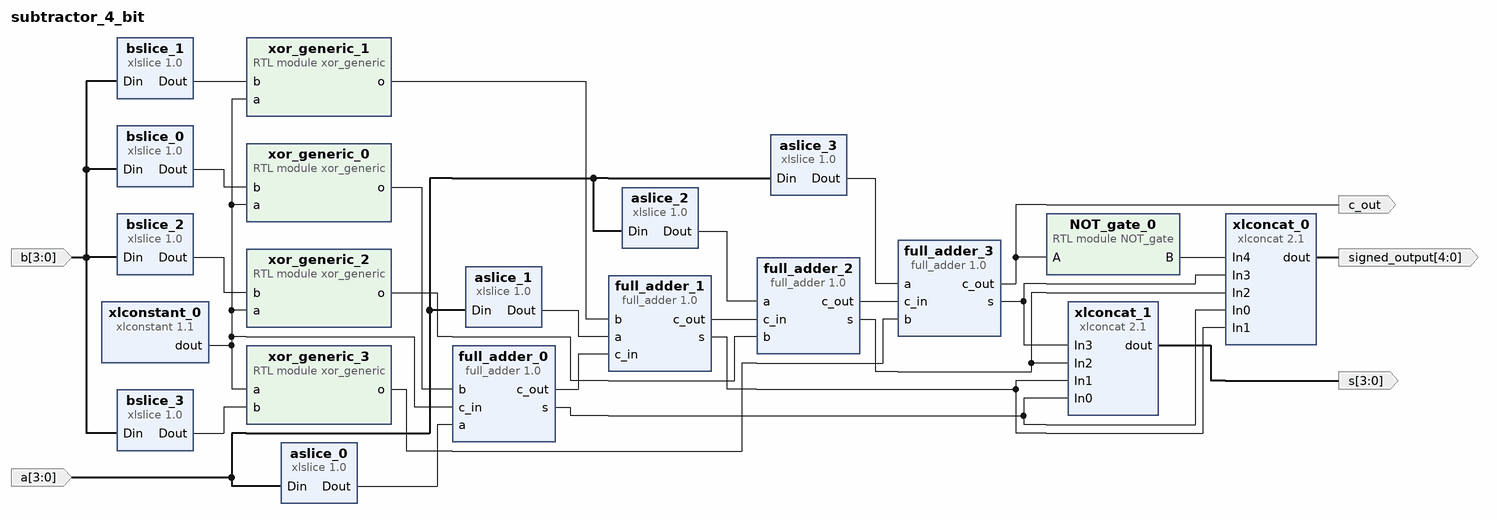
[diagram p0: block diagram of the top level]
# Vivado block design subtractor_4_bit, xc7z020clg400-1, Vivado 2023.2
create_bd_design subtractor_4_bit

create_bd_port -dir I -from 3 -to 0 a
create_bd_port -dir I -from 3 -to 0 b
create_bd_port -dir O -from 4 -to 0 signed_output
create_bd_port -dir O c_out
create_bd_port -dir O -from 3 -to 0 s

create_bd_cell -type module -reference xor_generic xor_generic_0
create_bd_cell -type ip -vlnv user.org:user:full_adder:1.0 full_adder_0
create_bd_cell -type ip -vlnv xilinx.com:ip:xlconstant:1.1 xlconstant_0
create_bd_cell -type ip -vlnv xilinx.com:ip:xlslice:1.0 bslice_0
set_property -dict {CONFIG.DIN_WIDTH 4} [get_bd_cells bslice_0]
create_bd_cell -type ip -vlnv user.org:user:full_adder:1.0 full_adder_1
create_bd_cell -type module -reference xor_generic xor_generic_1
create_bd_cell -type ip -vlnv xilinx.com:ip:xlslice:1.0 aslice_0
set_property -dict {CONFIG.DIN_FROM 0 CONFIG.DIN_TO 0 CONFIG.DIN_WIDTH 4} [get_bd_cells aslice_0]
create_bd_cell -type ip -vlnv xilinx.com:ip:xlslice:1.0 bslice_1
set_property -dict {CONFIG.DIN_FROM 1 CONFIG.DIN_TO 1 CONFIG.DIN_WIDTH 4} [get_bd_cells bslice_1]
create_bd_cell -type ip -vlnv xilinx.com:ip:xlslice:1.0 bslice_2
set_property -dict {CONFIG.DIN_FROM 2 CONFIG.DIN_TO 2 CONFIG.DIN_WIDTH 4} [get_bd_cells bslice_2]
create_bd_cell -type ip -vlnv xilinx.com:ip:xlslice:1.0 bslice_3
set_property -dict {CONFIG.DIN_FROM 3 CONFIG.DIN_TO 3 CONFIG.DIN_WIDTH 4} [get_bd_cells bslice_3]
create_bd_cell -type ip -vlnv xilinx.com:ip:xlslice:1.0 aslice_1
set_property -dict {CONFIG.DIN_FROM 1 CONFIG.DIN_TO 1 CONFIG.DIN_WIDTH 4} [get_bd_cells aslice_1]
create_bd_cell -type ip -vlnv xilinx.com:ip:xlslice:1.0 aslice_2
set_property -dict {CONFIG.DIN_FROM 2 CONFIG.DIN_TO 2 CONFIG.DIN_WIDTH 4} [get_bd_cells aslice_2]
create_bd_cell -type ip -vlnv xilinx.com:ip:xlslice:1.0 aslice_3
set_property -dict {CONFIG.DIN_FROM 3 CONFIG.DIN_TO 3 CONFIG.DIN_WIDTH 4} [get_bd_cells aslice_3]
create_bd_cell -type module -reference xor_generic xor_generic_2
create_bd_cell -type module -reference xor_generic xor_generic_3
create_bd_cell -type ip -vlnv user.org:user:full_adder:1.0 full_adder_2
create_bd_cell -type ip -vlnv user.org:user:full_adder:1.0 full_adder_3
create_bd_cell -type ip -vlnv xilinx.com:ip:xlconcat:2.1 xlconcat_0
set_property -dict {CONFIG.NUM_PORTS 5} [get_bd_cells xlconcat_0]
create_bd_cell -type module -reference NOT_gate NOT_gate_0
create_bd_cell -type ip -vlnv xilinx.com:ip:xlconcat:2.1 xlconcat_1
set_property -dict {CONFIG.NUM_PORTS 4} [get_bd_cells xlconcat_1]

# ---- connections ----

connect_bd_net [get_bd_pins NOT_gate_0/B] [get_bd_pins xlconcat_0/In4]
connect_bd_net [get_bd_ports a] [get_bd_pins aslice_0/Din] [get_bd_pins aslice_1/Din] [get_bd_pins aslice_2/Din] [get_bd_pins aslice_3/Din]
connect_bd_net [get_bd_pins aslice_0/Dout] [get_bd_pins full_adder_0/a]
connect_bd_net [get_bd_pins aslice_1/Dout] [get_bd_pins full_adder_1/a]
connect_bd_net [get_bd_pins aslice_2/Dout] [get_bd_pins full_adder_2/a]
connect_bd_net [get_bd_pins aslice_3/Dout] [get_bd_pins full_adder_3/a]
connect_bd_net [get_bd_ports b] [get_bd_pins bslice_1/Din] [get_bd_pins bslice_2/Din] [get_bd_pins bslice_0/Din] [get_bd_pins bslice_3/Din]
connect_bd_net [get_bd_pins bslice_0/Dout] [get_bd_pins xor_generic_0/b]
connect_bd_net [get_bd_pins bslice_1/Dout] [get_bd_pins xor_generic_1/b]
connect_bd_net [get_bd_pins bslice_2/Dout] [get_bd_pins xor_generic_2/b]
connect_bd_net [get_bd_pins bslice_3/Dout] [get_bd_pins xor_generic_3/b]
connect_bd_net [get_bd_pins full_adder_0/c_out] [get_bd_pins full_adder_1/c_in]
connect_bd_net [get_bd_pins full_adder_0/s] [get_bd_pins xlconcat_0/In0] [get_bd_pins xlconcat_1/In0]
connect_bd_net [get_bd_pins full_adder_1/c_out] [get_bd_pins full_adder_2/c_in]
connect_bd_net [get_bd_pins full_adder_1/s] [get_bd_pins xlconcat_0/In1] [get_bd_pins xlconcat_1/In1]
connect_bd_net [get_bd_pins full_adder_2/c_out] [get_bd_pins full_adder_3/c_in]
connect_bd_net [get_bd_pins full_adder_2/s] [get_bd_pins xlconcat_0/In2] [get_bd_pins xlconcat_1/In2]
connect_bd_net [get_bd_pins full_adder_3/c_out] [get_bd_pins NOT_gate_0/A] [get_bd_ports c_out]
connect_bd_net [get_bd_pins full_adder_3/s] [get_bd_pins xlconcat_0/In3] [get_bd_pins xlconcat_1/In3]
connect_bd_net [get_bd_pins xlconcat_0/dout] [get_bd_ports signed_output]
connect_bd_net [get_bd_pins xlconcat_1/dout] [get_bd_ports s]
connect_bd_net [get_bd_pins xlconstant_0/dout] \
  [get_bd_pins xor_generic_0/a] [get_bd_pins xor_generic_1/a] [get_bd_pins xor_generic_2/a] [get_bd_pins xor_generic_3/a] \
  [get_bd_pins full_adder_0/c_in]
connect_bd_net [get_bd_pins xor_generic_0/o] [get_bd_pins full_adder_0/b]
connect_bd_net [get_bd_pins xor_generic_1/o] [get_bd_pins full_adder_1/b]
connect_bd_net [get_bd_pins xor_generic_2/o] [get_bd_pins full_adder_2/b]
connect_bd_net [get_bd_pins xor_generic_3/o] [get_bd_pins full_adder_3/b]

validate_bd_design
save_bd_design
